# Altium schematic sheet 光耦开关量输入输出.SchDoc
size A3; SheetNumber: 3; SheetTotal: 6
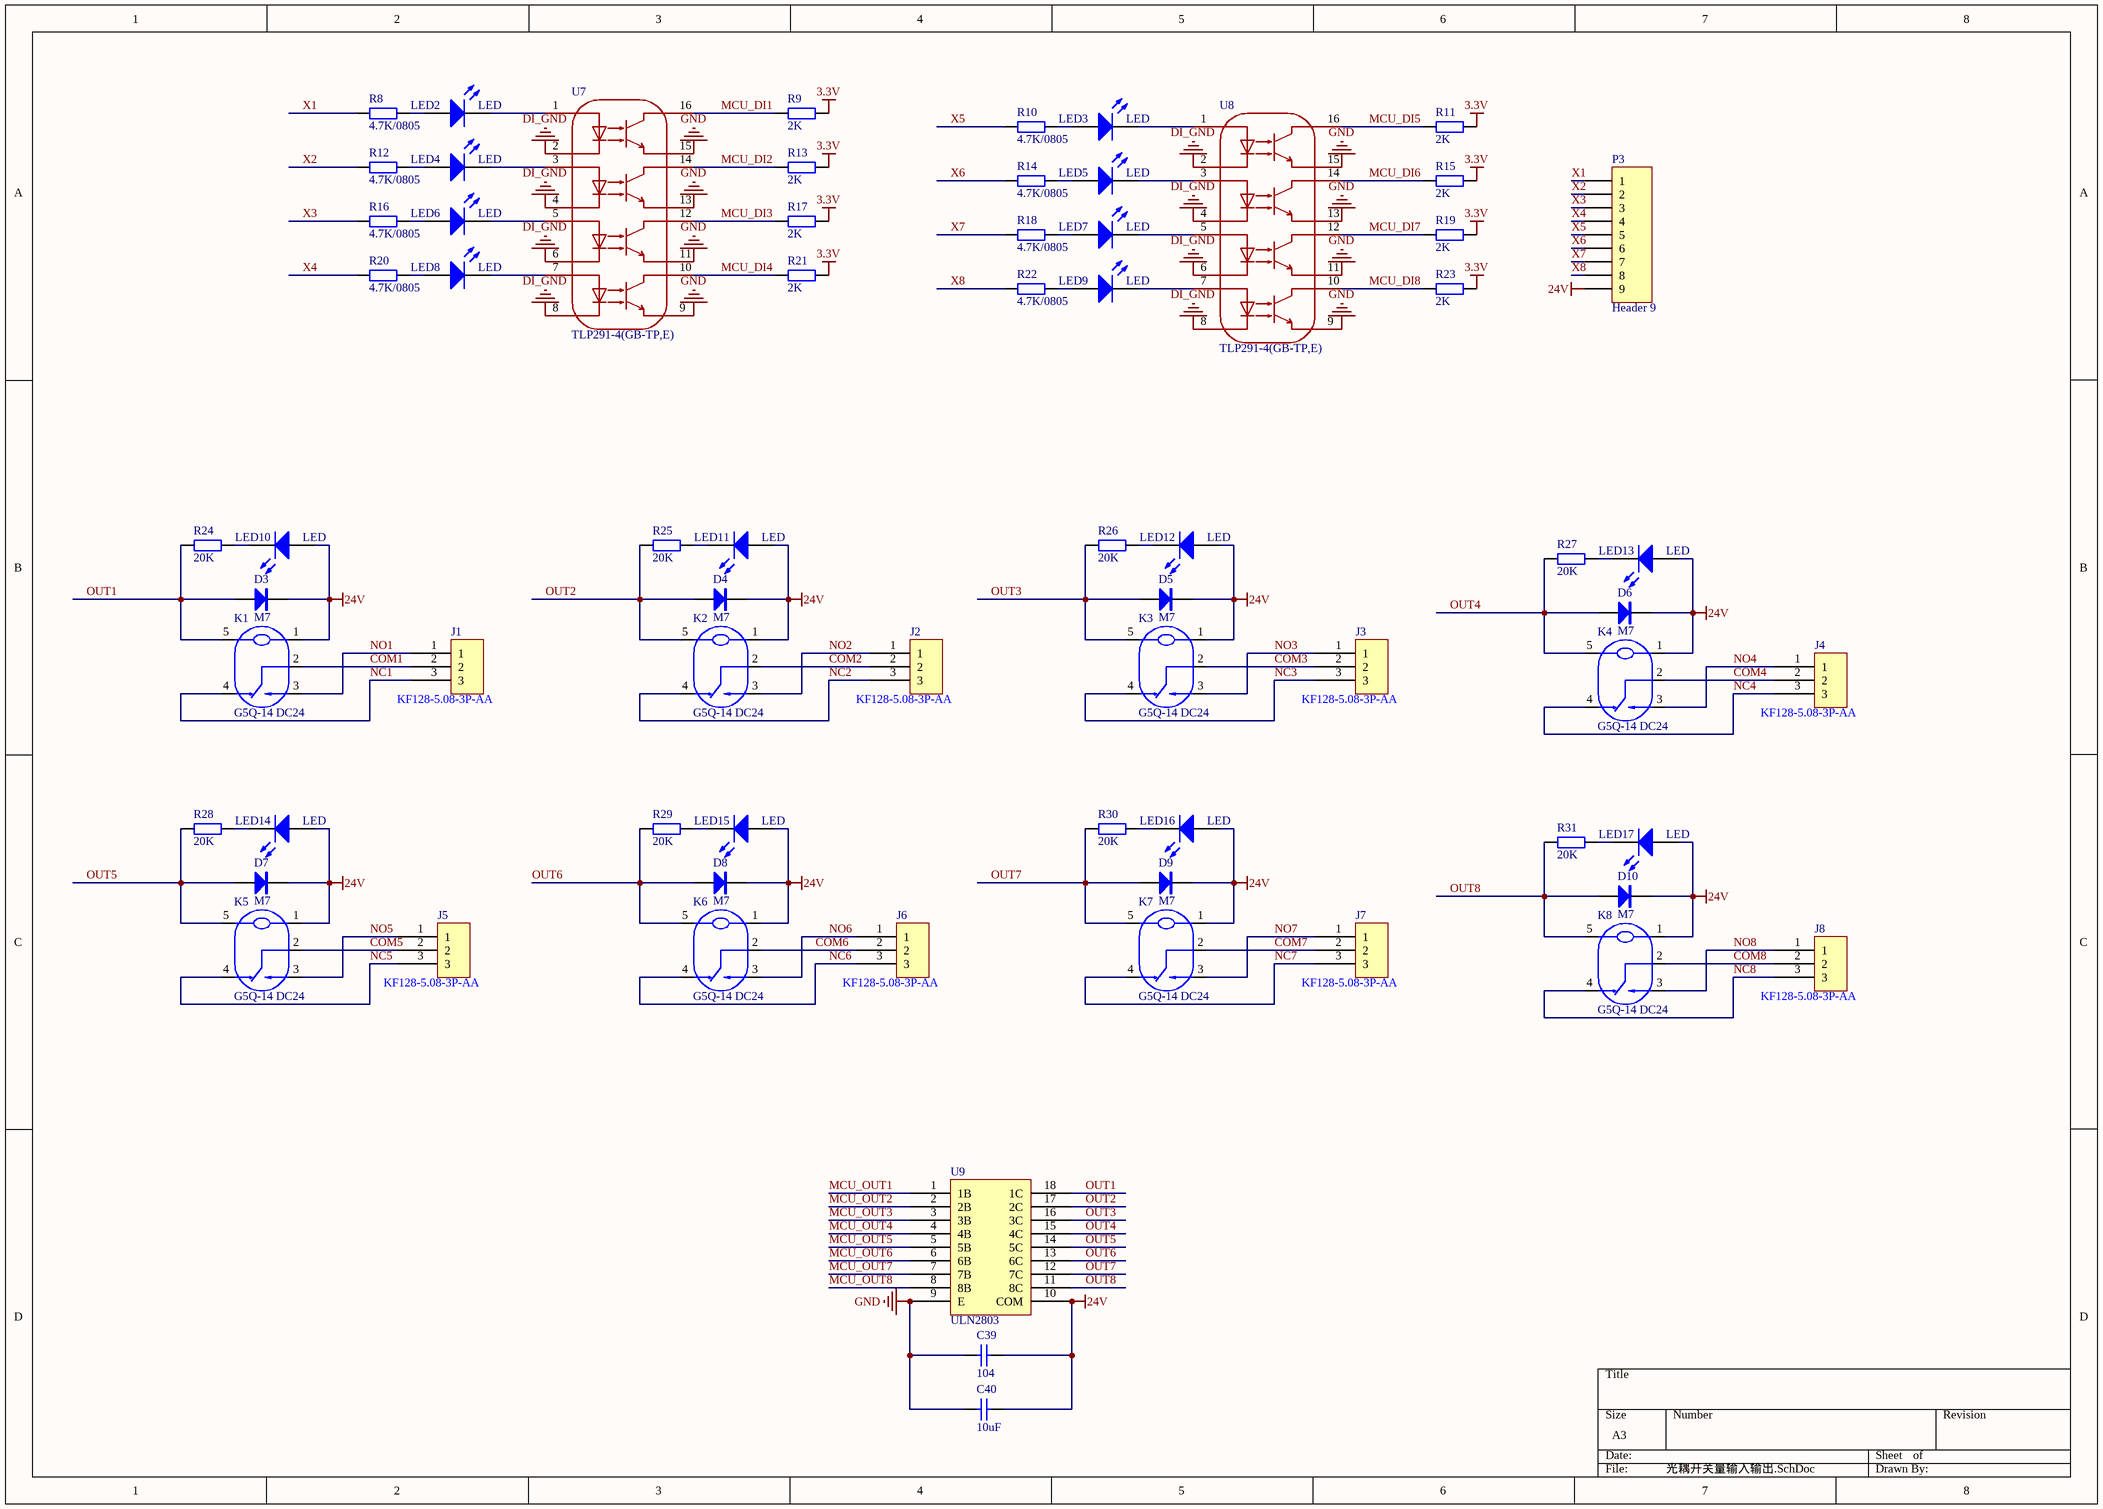
[diagram p0: 光耦开关量输入输出.SchDoc]

## Parts
C39  104  [C 0603_L]
C40  10uF  [C 0603_L]
D3  M7  [SMA]
D4  M7  [SMA]
D5  M7  [SMA]
D6  M7  [SMA]
D7  M7  [SMA]
D8  M7  [SMA]
D9  M7  [SMA]
D10  M7  [SMA]
J1  KF128-5.08-3P-AA  [KF128-5.08-3P]
J2  KF128-5.08-3P-AA  [KF128-5.08-3P]
J3  KF128-5.08-3P-AA  [KF128-5.08-3P]
J4  KF128-5.08-3P-AA  [KF128-5.08-3P]
J5  KF128-5.08-3P-AA  [KF128-5.08-3P]
J6  KF128-5.08-3P-AA  [KF128-5.08-3P]
J7  KF128-5.08-3P-AA  [KF128-5.08-3P]
J8  KF128-5.08-3P-AA  [KF128-5.08-3P]
K1  G5Q-14 DC24  [RELAY-TH_G5Q-14-DCXX]
K2  G5Q-14 DC24  [RELAY-TH_G5Q-14-DCXX]
K3  G5Q-14 DC24  [RELAY-TH_G5Q-14-DCXX]
K4  G5Q-14 DC24  [RELAY-TH_G5Q-14-DCXX]
K5  G5Q-14 DC24  [RELAY-TH_G5Q-14-DCXX]
K6  G5Q-14 DC24  [RELAY-TH_G5Q-14-DCXX]
K7  G5Q-14 DC24  [RELAY-TH_G5Q-14-DCXX]
K8  G5Q-14 DC24  [RELAY-TH_G5Q-14-DCXX]
LED2  LED  [LED 0603R]
LED3  LED  [LED 0603R]
LED4  LED  [LED 0603R]
LED5  LED  [LED 0603R]
LED6  LED  [LED 0603R]
LED7  LED  [LED 0603R]
LED8  LED  [LED 0603R]
LED9  LED  [LED 0603R]
LED10  LED  [LED 0603R]
LED11  LED  [LED 0603R]
LED12  LED  [LED 0603R]
LED13  LED  [LED 0603R]
LED14  LED  [LED 0603R]
LED15  LED  [LED 0603R]
LED16  LED  [LED 0603R]
LED17  LED  [LED 0603R]
P3  Header 9  [KF128-5.08-9P]
R8  4.7K/0805  [R0805_L]
R9  2K  [R 0603_L]
R10  4.7K/0805  [R0805_L]
R11  2K  [R 0603_L]
R12  4.7K/0805  [R0805_L]
R13  2K  [R 0603_L]
R14  4.7K/0805  [R0805_L]
R15  2K  [R 0603_L]
R16  4.7K/0805  [R0805_L]
R17  2K  [R 0603_L]
R18  4.7K/0805  [R0805_L]
R19  2K  [R 0603_L]
R20  4.7K/0805  [R0805_L]
R21  2K  [R 0603_L]
R22  4.7K/0805  [R0805_L]
R23  2K  [R 0603_L]
R24  20K  [R 0603_L]
R25  20K  [R 0603_L]
R26  20K  [R 0603_L]
R27  20K  [R 0603_L]
R28  20K  [R 0603_L]
R29  20K  [R 0603_L]
R30  20K  [R 0603_L]
R31  20K  [R 0603_L]
U7  TLP291-4(GB-TP,E)  [SOP-16_L10.3-W4.4-P1.27-LS7.0-BL]
U8  TLP291-4(GB-TP,E)  [SOP-16_L10.3-W4.4-P1.27-LS7.0-BL]
U9  ULN2803  [SOP-18_L11.6-W7.5-P1.27-LS10.3-BL]

## Nets
3.3V: R9.1 R11.1 R13.1 R15.1 R17.1 R19.1 R21.1 R23.1
24V: C39.1 C40.1 D3.2(K) D4.2(K) D5.2(K) D6.2(K) D7.2(K) D8.2(K) D9.2(K) D10.2(K) K1.1 K2.1 K3.1 K4.1 K5.1 K6.1 K7.1 K8.1 LED10.1(A) LED11.1(A) LED12.1(A) LED13.1(A) LED14.1(A) LED15.1(A) LED16.1(A) LED17.1(A) P3.9 U9.10(COM)
DI_GND: U7.2 U7.4 U7.6 U7.8 U8.2 U8.4 U8.6 U8.8
GND: C39.2 C40.2 U7.9 U7.11 U7.13 U7.15 U8.9 U8.11 U8.13 U8.15 U9.9(E)
COM1: J1.2 K1.2
COM2: J2.2 K2.2
COM3: J3.2 K3.2
COM4: J4.2 K4.2
COM5: J5.2 K5.2
COM6: J6.2 K6.2
COM7: J7.2 K7.2
COM8: J8.2 K8.2
MCU_DI1: R9.2 U7.16
MCU_DI2: R13.2 U7.14
MCU_DI3: R17.2 U7.12
MCU_DI4: R21.2 U7.10
MCU_DI5: R11.2 U8.16
MCU_DI6: R15.2 U8.14
MCU_DI7: R19.2 U8.12
MCU_DI8: R23.2 U8.10
MCU_OUT1: U9.1(1B)
MCU_OUT2: U9.2(2B)
MCU_OUT3: U9.3(3B)
MCU_OUT4: U9.4(4B)
MCU_OUT5: U9.5(5B)
MCU_OUT6: U9.6(6B)
MCU_OUT7: U9.7(7B)
MCU_OUT8: U9.8(8B)
NC1: J1.3 K1.4
NC2: J2.3 K2.4
NC3: J3.3 K3.4
NC4: J4.3 K4.4
NC5: J5.3 K5.4
NC6: J6.3 K6.4
NC7: J7.3 K7.4
NC8: J8.3 K8.4
NO1: J1.1 K1.3
NO2: J2.1 K2.3
NO3: J3.1 K3.3
NO4: J4.1 K4.3
NO5: J5.1 K5.3
NO6: J6.1 K6.3
NO7: J7.1 K7.3
NO8: J8.1 K8.3
OUT1: D3.1(A) K1.5 R24.2 U9.18(1C)
OUT2: D4.1(A) K2.5 R25.2 U9.17(2C)
OUT3: D5.1(A) K3.5 R26.2 U9.16(3C)
OUT4: D6.1(A) K4.5 R27.2 U9.15(4C)
OUT5: D7.1(A) K5.5 R28.2 U9.14(5C)
OUT6: D8.1(A) K6.5 R29.2 U9.13(6C)
OUT7: D9.1(A) K7.5 R30.2 U9.12(7C)
OUT8: D10.1(A) K8.5 R31.2 U9.11(8C)
X1: P3.1 R8.1
X2: P3.2 R12.1
X3: P3.3 R16.1
X4: P3.4 R20.1
X5: P3.5 R10.1
X6: P3.6 R14.1
X7: P3.7 R18.1
X8: P3.8 R22.1
NetLED2_1: LED2.1(A) R8.2
NetLED2_2: LED2.2(K) U7.1
NetLED3_1: LED3.1(A) R10.2
NetLED3_2: LED3.2(K) U8.1
NetLED4_1: LED4.1(A) R12.2
NetLED4_2: LED4.2(K) U7.3
NetLED5_1: LED5.1(A) R14.2
NetLED5_2: LED5.2(K) U8.3
NetLED6_1: LED6.1(A) R16.2
NetLED6_2: LED6.2(K) U7.5
NetLED7_1: LED7.1(A) R18.2
NetLED7_2: LED7.2(K) U8.5
NetLED8_1: LED8.1(A) R20.2
NetLED8_2: LED8.2(K) U7.7
NetLED9_1: LED9.1(A) R22.2
NetLED9_2: LED9.2(K) U8.7
NetLED10_2: LED10.2(K) R24.1
NetLED11_2: LED11.2(K) R25.1
NetLED12_2: LED12.2(K) R26.1
NetLED13_2: LED13.2(K) R27.1
NetLED14_2: LED14.2(K) R28.1
NetLED15_2: LED15.2(K) R29.1
NetLED16_2: LED16.2(K) R30.1
NetLED17_2: LED17.2(K) R31.1

## Library data of the parts
C39 C40 = Cap: 0603贴片电容; Published: 8-Jun-2000; LatestRevisionDate: 17-Jul-2002; LatestRevisionNote: Re-released for DXP Platform.; PackageReference: RAD-0.3; Publisher: Altium Limited; PackageDescription: Radial Cap, Thru-Hole; 2 Leads; 0.3 in Pin Spacing
D3-D10 = M7: 整流二极管; 淘宝ID: 封装库来自淘宝 ID：黄晶宝石; 封装库来自淘宝卖家 ID：黄晶宝石: 其他店铺购入均为盗版，不享受售后技术支持服务，请立即申请退款; BOM名称: 整流二极管; 联系售后，技术支持: https://shop463601444.taobao.com
J1-J8 = KF128-5.08-3P-AA: KF128-5.08-3P-AA端座; Manufacturer: KEFA(科发); Add into BOM: yes; Structure: 1x3P; Pitch: 5.08mm; Current Rating (Max): 24A; Voltage Rating (Max): 250V; Wire Gauge - AWG: 12~22; Wire Gauge - mm2: 2.5; Number of PINs Per Row: 3; Symbol: KF128-5.08-3P; Device: KF128-5.08-3P-AA; LCSC Part Name: 5.08mm 1x3P 排数:1 每排P数:3 直插; Supplier Part: C474953; Manufacturer Part: KF128-5.08-3P-AA; Supplier Footprint: 插件,P=5.08mm; JLCPCB Part Class: 扩展库; Datasheet: https://atta.szlcsc.com/upload/public/pdf/source/20230317/DADFED05827EAD48C1D5B8C3D4CF88F4.pdf; Supplier: LCSC; Convert to PCB: yes; Color: 绿色; Mounting Style: 直插; Number of Pins: 3P; Number of Rows: 1; Operating Temperature Range: -40℃~+105℃
K1-K8 = G5Q-14 DC24: 欧姆龙24V继电器，单刀双掷; Manufacturer: OMRON(欧姆龙); Symbol: G5Q-14-DC24; Add into BOM: yes; Coil Voltage: 24V; Contact Form: 一组转换:1C(单刀双掷-转换); Contact Rating: 10A@250VAC；3A@30VDC；5A@30VDC；3A@250VAC; Switching Voltage(Max): 277V@AC；30V@DC; Coil Rated Power: 400mW; Coil Resistance: 1.44kΩ; Contact Resistance: 100mΩ; Operate Time: 10ms; Release Time: 5ms; Device: G5Q-14 DC24; LCSC Part Name: 24V 一组转换:1C(单刀双掷-转换); Supplier Part: C397242; Manufacturer Part: G5Q-14 DC24; Supplier Footprint: 插件,20x10mm; JLCPCB Part Class: 扩展库; Datasheet: https://item.szlcsc.com/datasheet/G5Q-14%2520DC24/378779.html; Supplier: LCSC; Convert to PCB: yes; Number of Pins: -; Contact Material: 银合金(无镉); Switching Current(Max): -; Coil Type: -; Operating Temperature: -40℃~+105℃
LED2-LED17 = LED: 0603发光二极管; Published: 8-Jun-2000; LatestRevisionDate: 08-Jul-2005; LatestRevisionNote: Mech Layer 1 removed.; PackageReference: LED-0; Publisher: Altium Limited; PackageDescription: LED; 2 Leads
P3 = Header 9: Header, 9-Pin; LatestRevisionDate: 17-Jul-2002; LatestRevisionNote: Re-released for DXP Platform.; Publisher: Altium Limited
R8 R10 R12 R14 R16 R18 R20 R22 = Res_15: R0805贴片电阻; BOM名称: 贴片电阻; 版权归属: 源创客; 学习资源: www.ooocke.com
R9 R11 R13 R15 R17 R19 R21 R23-R31 = Res: 0603贴片电阻; BOM名称: 贴片电阻; 版权归属: 源创客; 学习资源: www.ooocke.com
U7 U8 = TLP291-4(GB-TP,E): 光耦; Manufacturer: TOSHIBA(东芝); Symbol: TLP291-4(GB-TP,E(T; Add into BOM: yes; Output Type: 光电三极管; Voltage - Forward(Vf): 1.2V; Output Current: 50mA; Isolation Voltage(Vrms): 2.5kV; Reverse Voltage: 5V; Load Voltage: 80V; Number of Outputs: 4; Vce Saturation(VCE(sat)): 400mV@2.4mA,8mA; Rise time: 2us; Fall time: 3us; Current Transfer Ratio (CTR) Minimum: 50%; Current Transfer Ratio (CTR) Maximum/Saturation Value: 400%; Device: TLP291-4(GB-TP,E); LCSC Part Name: DC输入 隔离电压(rms):2500V; Supplier Part: C60900; Manufacturer Part: TLP291-4(GB-TP,E); Supplier Footprint: SOP-16-4.4mm; JLCPCB Part Class: 扩展库; Datasheet: https://item.szlcsc.com/datasheet/TLP291-4(GB-TP%252CE)/61952.html; Supplier: LCSC; Convert to PCB: yes; Input voltage type: -; Operating Temperature: -55℃~+110℃
U9 = ULN2803: 达林顿驱动; Manufacturer: Siproin(上海矽朋); Symbol: ULN2803_C2758014; Add into BOM: yes; number of channels: 八路; Collector - Emitter Voltage VCEO: 50V; Current - Collector(Ic): 500mA; Voltage - Input(Max): 30V; Input Current(off): 65uA; Voltage - Forward(Vf): 1.7V; Reverse Leakage Current (Ir): 100uA; Input Capacitiance(Ci): 15pF; Device: ULN2803; LCSC Part Name: 高压大电流达林顿晶体管阵列; Supplier Part: C2758014; Manufacturer Part: ULN2803; Supplier Footprint: SOP-18-300mil; JLCPCB Part Class: 扩展库; Datasheet: https://item.szlcsc.com/datasheet/ULN2803/2875179.html; Supplier: LCSC; Convert to PCB: yes; Operating Temperature: -20℃~+70℃